# Altium schematic sheet SD_NRF_RC522_W5500.SchDoc
size A4
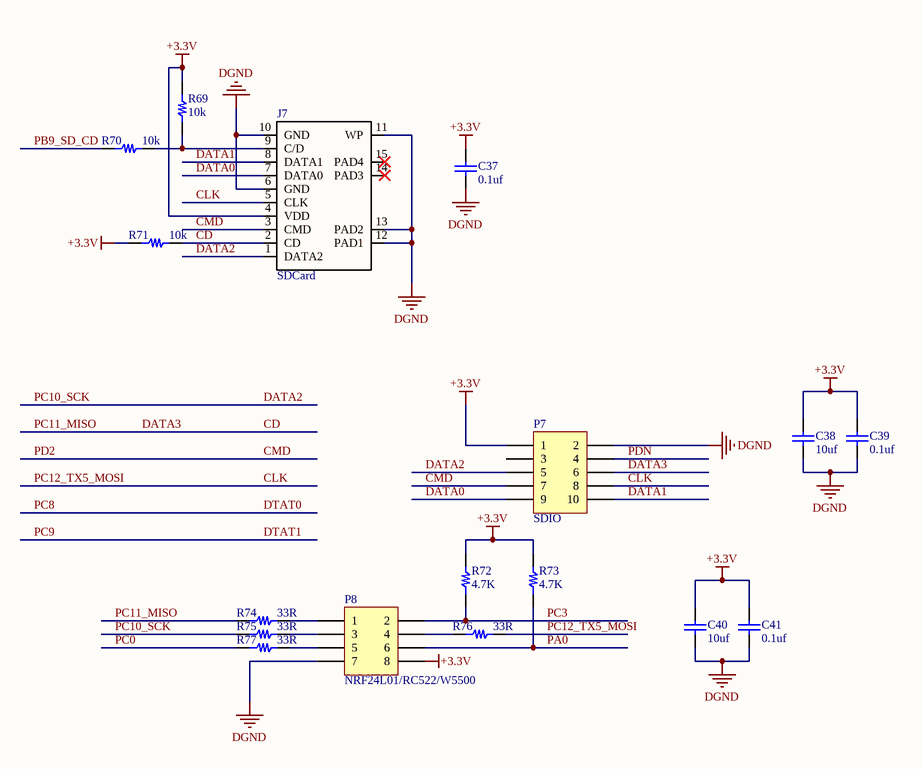
[diagram p0: SD_NRF_RC522_W5500.SchDoc]

## Parts
C37  0.1uf  [0805C]
C38  10uf  [0805C]
C39  0.1uf  [0805C]
C40  10uf  [0805C]
C41  0.1uf  [0805C]
J7  SDCard  [TFP09-2-12B]
P7  SDIO  [HDR2X5-2.54MM]
P8  NRF24L01/RC522/W5500  [HDR2X4-2.54MM]
R69  10k  [0805_small]
R70  10k  [0805_small]
R71  10k  [0805_small]
R72  4.7K  [0805_small]
R73  4.7K  [0805_small]
R74  33R  [0805_small]
R75  33R  [0805_small]
R76  33R  [0805_small]
R77  33R  [0805_small]

## Nets
+3.3V: C37.1 C38.1 C39.1 C40.1 C41.1 J7.4(VDD) P7.1 P8.8 R69.1 R71.1 R72.2 R73.2
DGND: C37.2 C38.2 C39.2 C40.2 C41.2 J7.6(GND) J7.10(GND) J7.11(WP) J7.12(PAD1) J7.13(PAD2) P7.2 P8.7
CD: J7.2(CD) P7.6 R71.2 R74.1  [also labelled DATA3, PC11_MISO]
CLK: J7.5(CLK) P7.8 R76.2  [also labelled PC12_TX5_MOSI]
CMD: J7.3(CMD) P7.7  [also labelled PD2]
DATA0: J7.7(DATA0) P7.9
DATA1: J7.8(DATA1) P7.10
DATA2: J7.1(DATA2) P7.5 R75.1  [also labelled PC10_SCK]
PA0: P8.6 R73.1
PB9_SD_CD: R70.1
PC0: R77.1
PC3: P8.2 R72.1
PDN: P7.4
NetJ7_9: J7.9(C/D) R69.2 R70.2
NetP8_1: P8.1 R74.2
NetP8_3: P8.3 R75.2
NetP8_4: P8.4 R76.1
NetP8_5: P8.5 R77.2

Not connected (* = marked no-connect by the designer): J7 14(PAD3)* 15(PAD4)*; P7 3

## Library data of the parts
C37-C41 = Cap: 贴片电容; Value: 100pF; Published: 8-Jun-2000; LatestRevisionDate: 17-Jul-2002; LatestRevisionNote: Re-released for DXP Platform.; PackageReference: RAD-0.3; Publisher: Altium Limited
J7 = sd_card_tf_0: 带弹簧的SD-TF卡座
P7 = CON5X2: Header, 5-Pin, Dual row; LatestRevisionDate: 17-Jul-2002; LatestRevisionNote: Re-released for DXP Platform.; Publisher: Altium Limited
P8 = CON4X2: Header, 4-Pin, Dual row; LatestRevisionDate: 17-Jul-2002; LatestRevisionNote: Re-released for DXP Platform.; Publisher: Altium Limited
R69-R77 = Res: 电阻; Value: 230k; Published: 24-Mar-1999; LatestRevisionDate: 29-May-2009; LatestRevisionNote: IPC-7351 Footprint Added.; PackageVersion: Mar-2003; PackageReference: 6-0805; Publisher: Altium Limited; PackageDescription: Chip Resistor 0805 Case Size; Code_IPC: RESC2012